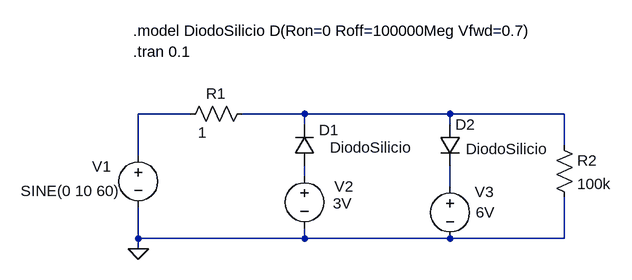
[diagram p0: schematic Diodo-Limitador-LTSpice.asc]
Diodo-Limitador-LTSpice.asc, the LTspice schematic file:
Version 4
SHEET 1 880 680
WIRE 64 32 -16 32
WIRE 240 32 144 32
WIRE 464 32 240 32
WIRE 640 32 464 32
WIRE 240 48 240 32
WIRE 464 48 464 32
WIRE 640 80 640 32
WIRE -16 96 -16 32
WIRE 240 128 240 112
WIRE 464 144 464 112
WIRE -16 224 -16 176
WIRE 240 224 240 208
WIRE 240 224 -16 224
WIRE 464 224 240 224
WIRE 640 224 640 160
WIRE 640 224 464 224
WIRE -16 240 -16 224
FLAG -16 240 0
SYMBOL voltage -16 80 R0
WINDOW 123 0 0 Left 2
WINDOW 39 0 0 Left 2
WINDOW 0 -71 33 Left 2
WINDOW 3 -181 71 Left 2
SYMATTR InstName V1
SYMATTR Value SINE(0 10 60)
SYMBOL voltage 240 112 R0
WINDOW 123 0 0 Left 2
WINDOW 39 0 0 Left 2
WINDOW 0 46 32 Left 2
WINDOW 3 44 58 Left 2
SYMATTR InstName V2
SYMATTR Value 3V
SYMBOL voltage 464 128 R0
WINDOW 123 0 0 Left 2
WINDOW 39 0 0 Left 2
WINDOW 0 38 24 Left 2
WINDOW 3 40 56 Left 2
SYMATTR InstName V3
SYMATTR Value 6V
SYMBOL res 160 16 R90
WINDOW 0 0 56 VBottom 2
WINDOW 3 29 77 VTop 2
SYMATTR InstName R1
SYMATTR Value 1
SYMBOL diode 256 112 R180
WINDOW 0 -37 55 Left 2
WINDOW 3 -148 28 Left 2
SYMATTR InstName D1
SYMATTR Value DiodoSilicio
SYMBOL diode 448 48 R0
WINDOW 3 40 38 Left 2
SYMATTR Value DiodoSilicio
SYMATTR InstName D2
SYMBOL res 624 64 R0
SYMATTR InstName R2
SYMATTR Value 100k
TEXT -24 -64 Left 2 !.tran 0.1
TEXT -24 -96 Left 2 !.model DiodoSilicio D(Ron=0 Roff=100000Meg Vfwd=0.7)

The netlist it stands for:
* Diodo-Limitador-LTSpice.asc
V1 N001 0 SINE(0 10 60)
V2 N003 0 3V
V3 N004 0 6V
R1 N002 N001 1
D1 N003 N002 DiodoSilicio
D2 N002 N004 DiodoSilicio
R2 N002 0 100k
.model D D
.lib standard.dio
.tran 0.1
.model DiodoSilicio D(Ron=0 Roff=100000Meg Vfwd=0.7)
.backanno
.end